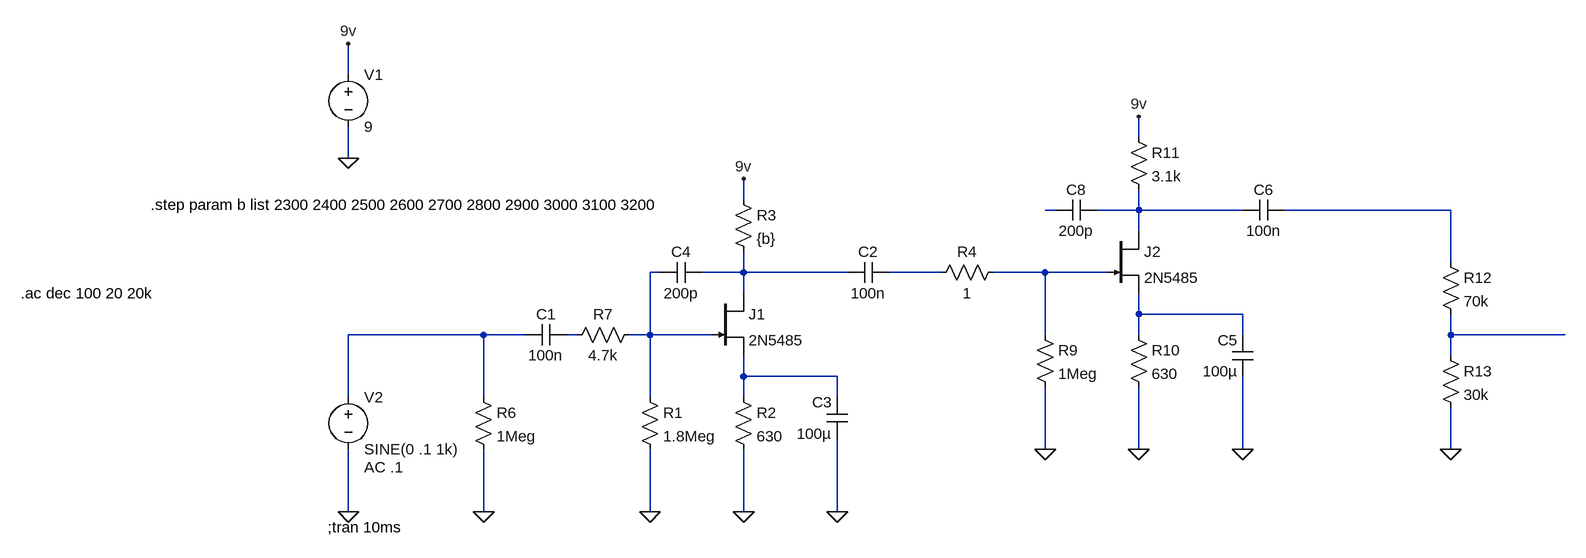
[diagram p0: schematic JFET_Dual_Stage.asc]
JFET_Dual_Stage.asc, the LTspice schematic file:
Version 4
SHEET 1 1956 680
WIRE -640 -160 -640 -208
WIRE 576 -64 576 -96
WIRE -640 -32 -640 -80
WIRE -32 32 -32 0
WIRE 448 48 432 48
WIRE 576 48 576 16
WIRE 576 48 512 48
WIRE 736 48 576 48
WIRE 1056 48 800 48
WIRE 576 80 576 48
WIRE 1056 128 1056 48
WIRE -160 144 -176 144
WIRE -32 144 -32 112
WIRE -32 144 -96 144
WIRE 128 144 -32 144
WIRE 272 144 192 144
WIRE 432 144 352 144
WIRE 528 144 432 144
WIRE -32 176 -32 144
WIRE 576 208 576 176
WIRE 736 208 576 208
WIRE -432 240 -640 240
WIRE -368 240 -432 240
WIRE -288 240 -304 240
WIRE -176 240 -176 144
WIRE -176 240 -208 240
WIRE -80 240 -176 240
WIRE 432 240 432 144
WIRE 576 240 576 208
WIRE 736 240 736 208
WIRE 1056 240 1056 208
WIRE 1232 240 1056 240
WIRE 1056 272 1056 240
WIRE -32 304 -32 272
WIRE 112 304 -32 304
WIRE -640 336 -640 240
WIRE -432 336 -432 240
WIRE -176 336 -176 240
WIRE -32 336 -32 304
WIRE 112 336 112 304
WIRE 432 416 432 320
WIRE 576 416 576 320
WIRE 736 416 736 304
WIRE 1056 416 1056 352
WIRE -640 512 -640 416
WIRE -432 512 -432 416
WIRE -176 512 -176 416
WIRE -32 512 -32 416
WIRE 112 512 112 400
FLAG -32 512 0
FLAG -176 512 0
FLAG 112 512 0
FLAG -640 -32 0
FLAG -640 512 0
FLAG -640 -208 9v
FLAG -32 0 9v
FLAG -432 512 0
FLAG 576 416 0
FLAG 432 416 0
FLAG 576 -96 9v
FLAG 1056 416 0
FLAG 736 416 0
SYMBOL njf -80 176 R0
SYMATTR InstName J1
SYMATTR Value 2N5485
SYMBOL cap -304 224 R90
WINDOW 0 0 32 VBottom 2
WINDOW 3 32 32 VTop 2
SYMATTR InstName C1
SYMATTR Value 100n
SYMBOL res -192 320 R0
SYMATTR InstName R1
SYMATTR Value 1.8Meg
SYMBOL res -48 320 R0
SYMATTR InstName R2
SYMATTR Value 630
SYMBOL res -48 16 R0
SYMATTR InstName R3
SYMATTR Value {b}
SYMBOL cap 192 128 R90
WINDOW 0 0 32 VBottom 2
WINDOW 3 32 32 VTop 2
SYMATTR InstName C2
SYMATTR Value 100n
SYMBOL cap 128 400 R180
WINDOW 0 24 56 Left 2
WINDOW 3 24 8 Left 2
SYMATTR InstName C3
SYMATTR Value 100µ
SYMBOL voltage -640 -176 R0
WINDOW 123 0 0 Left 2
WINDOW 39 0 0 Left 2
SYMATTR InstName V1
SYMATTR Value 9
SYMBOL voltage -640 320 R0
WINDOW 123 24 124 Left 2
WINDOW 39 0 0 Left 2
SYMATTR Value2 AC .1
SYMATTR InstName V2
SYMATTR Value SINE(0 .1 1k)
SYMBOL res -448 320 R0
SYMATTR InstName R6
SYMATTR Value 1Meg
SYMBOL cap -96 128 R90
WINDOW 0 0 32 VBottom 2
WINDOW 3 32 32 VTop 2
SYMATTR InstName C4
SYMATTR Value 200p
SYMBOL res -192 224 R90
WINDOW 0 0 56 VBottom 2
WINDOW 3 32 56 VTop 2
SYMATTR InstName R7
SYMATTR Value 4.7k
SYMBOL njf 528 80 R0
SYMATTR InstName J2
SYMATTR Value 2N5485
SYMBOL res 416 224 R0
SYMATTR InstName R9
SYMATTR Value 1Meg
SYMBOL res 560 224 R0
SYMATTR InstName R10
SYMATTR Value 630
SYMBOL res 560 -80 R0
SYMATTR InstName R11
SYMATTR Value 3.1k
SYMBOL cap 800 32 R90
WINDOW 0 0 32 VBottom 2
WINDOW 3 32 32 VTop 2
SYMATTR InstName C6
SYMATTR Value 100n
SYMBOL res 1040 112 R0
SYMATTR InstName R12
SYMATTR Value 70k
SYMBOL res 1040 256 R0
SYMATTR InstName R13
SYMATTR Value 30k
SYMBOL cap 512 32 R90
WINDOW 0 0 32 VBottom 2
WINDOW 3 32 32 VTop 2
SYMATTR InstName C8
SYMATTR Value 200p
SYMBOL res 368 128 R90
WINDOW 0 0 56 VBottom 2
WINDOW 3 32 56 VTop 2
SYMATTR InstName R4
SYMATTR Value 1
SYMBOL cap 752 304 R180
WINDOW 0 24 56 Left 2
WINDOW 3 24 8 Left 2
SYMATTR InstName C5
SYMATTR Value 100µ
TEXT -672 536 Left 2 !;tran 10ms
TEXT -1144 176 Left 2 !.ac dec 100 20 20k
TEXT -944 40 Left 2 !.step param b list 2300 2400 2500 2600 2700 2800 2900 3000 3100 3200

The netlist it stands for:
* JFET_Dual_Stage.asc
J1 N005 N004 N012 2N5485
C1 N010 N009 100n
R1 N004 0 1.8Meg
R2 N012 0 630
R3 9v N005 {b}
C2 N006 N005 100n
C3 0 N012 100µ
V1 9v 0 9
V2 N009 0 SINE(0 .1 1k) AC .1
R6 N009 0 1Meg
C4 N005 N004 200p
R7 N004 N010 4.7k
J2 N002 N007 N008 2N5485
R9 N007 0 1Meg
R10 N008 0 630
R11 9v N002 3.1k
C6 N003 N002 100n
R12 N003 N011 70k
R13 N011 0 30k
C8 N002 N001 200p
R4 N007 N006 1
C5 0 N008 100µ
.model NJF NJF
.model PJF PJF
.lib standard.jft
;tran 10ms
.ac dec 100 20 20k
.step param b list 2300 2400 2500 2600 2700 2800 2900 3000 3100 3200
.backanno
.end